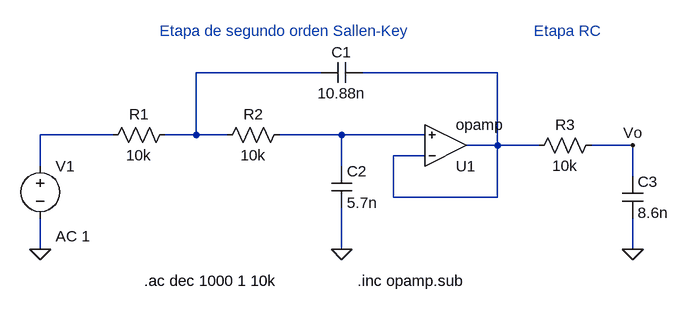
[diagram p0: schematic tarea3.asc]
tarea3.asc, the LTspice schematic file:
Version 4.1
SHEET 1 880 680
WIRE 256 48 64 48
WIRE 528 48 320 48
WIRE -64 144 -176 144
WIRE 64 144 64 48
WIRE 64 144 16 144
WIRE 112 144 64 144
WIRE 288 144 192 144
WIRE 416 144 288 144
WIRE 528 160 528 48
WIRE 528 160 480 160
WIRE 592 160 528 160
WIRE 736 160 672 160
WIRE 416 176 368 176
WIRE -176 192 -176 144
WIRE 288 192 288 144
WIRE 736 208 736 160
WIRE 368 240 368 176
WIRE 528 240 528 160
WIRE 528 240 368 240
WIRE -176 320 -176 272
WIRE 288 320 288 256
WIRE 736 320 736 272
FLAG 288 320 0
FLAG 736 320 0
FLAG -176 320 0
FLAG 736 160 Vo
SYMBOL res 32 128 R90
WINDOW 0 0 56 VBottom 2
WINDOW 3 32 56 VTop 2
SYMATTR InstName R1
SYMATTR Value 10k
SYMBOL res 208 128 R90
WINDOW 0 0 56 VBottom 2
WINDOW 3 32 56 VTop 2
SYMATTR InstName R2
SYMATTR Value 10k
SYMBOL res 688 144 R90
WINDOW 0 0 56 VBottom 2
WINDOW 3 32 56 VTop 2
SYMATTR InstName R3
SYMATTR Value 10k
SYMBOL cap 320 32 R90
WINDOW 0 0 32 VBottom 2
WINDOW 3 32 32 VTop 2
SYMATTR InstName C1
SYMATTR Value 10.88n
SYMBOL cap 272 192 R0
SYMATTR InstName C2
SYMATTR Value 5.7n
SYMBOL cap 720 208 R0
SYMATTR InstName C3
SYMATTR Value 8.6n
SYMBOL OpAmps\\opamp 448 224 M180
SYMATTR InstName U1
SYMBOL voltage -176 176 R0
WINDOW 123 24 124 Left 2
WINDOW 39 0 0 Left 0
SYMATTR InstName V1
SYMATTR Value ""
SYMATTR Value2 AC 1
TEXT 8 -16 Left 2 ;Etapa de segundo orden Sallen-Key
TEXT 584 -16 Left 2 ;Etapa RC
TEXT -16 368 Left 2 !.ac dec 1000 1 10k
TEXT 312 368 Left 2 !.inc opamp.sub

The netlist it stands for:
* tarea3.asc
R1 N001 N003 10k
R2 N004 N001 10k
R3 Vo N002 10k
C1 N002 N001 10.88n
C2 N004 0 5.7n
C3 Vo 0 8.6n
X§U1 N002 N004 N002 opamp Aol=100K GBW=10Meg  ; pins invin noninvin out
V1 N003 0 AC 1
* Etapa de segundo orden Sallen-Key
* Etapa RC
.ac dec 1000 1 10k
.inc opamp.sub
.backanno
.end